# EAGLE design LED_Driver (EAGLE 9.7.0)
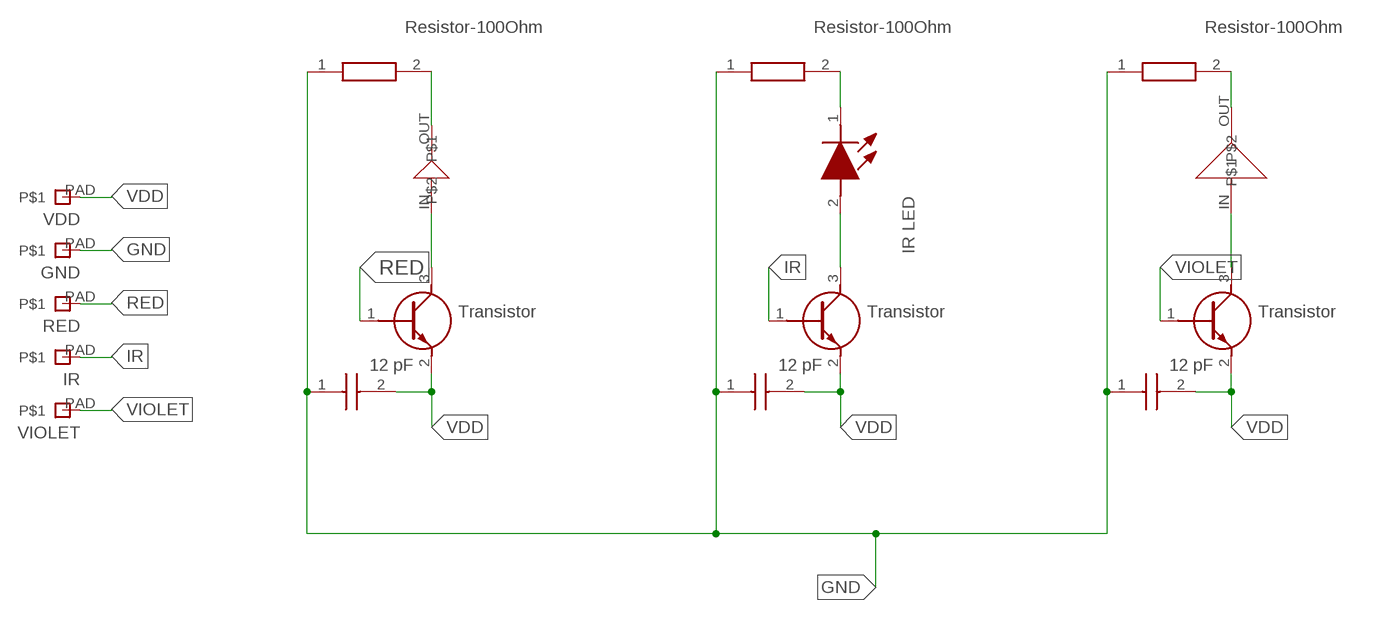
[diagram p0: schematic, sheet 1]

## Parts
C1  CAPACITOR-12PF  [CAPC1005X55N]
C3  CAPACITOR-12PF  [CAPC1005X55N]
C5  CAPACITOR-12PF  [CAPC1005X55N]
GND  PAD  [PAD]
IR  PAD  [PAD]
LED1  IRLED  [LEDC3216X180N]
Q1  TRANSISTOR  [SOT883B]
Q3  TRANSISTOR  [SOT883B]
Q5  TRANSISTOR  [SOT883B]
R1  RESISTOR-100OHM  [RESC1608X55N]
R3  RESISTOR-100OHM  [RESC1608X55N]
R5  RESISTOR-100OHM  [RESC1608X55N]
RED  PAD  [PAD]
U$1  REDLED  [REDLED]
U$3  UVLED  [UVLED]
VDD  PAD  [PAD]
VIOLET  PAD  [PAD]

## Nets
GND: C1.1 C3.1 C5.1 GND.PAD R1.1 R3.1 R5.1
IR: IR.PAD Q3.1(B)
N$7: Q1.3(C) U$1.IN
N$9: LED1.2(A) Q3.3(C)
N$11: Q5.3(C) U$3.IN
N$13: R1.2 U$1.OUT
N$15: LED1.1(K) R3.2
N$17: R5.2 U$3.OUT
RED: Q1.1(B) RED.PAD
VDD: C1.2 C3.2 C5.2 Q1.2(E) Q3.2(E) Q5.2(E) VDD.PAD
VIOLET: Q5.1(B) VIOLET.PAD

## Library data of the parts
C1 C3 C5 = MABOS_Library:CAPACITOR-12PF: 12 pF; DESCRIPTION: Multilayer Ceramic Capacitors MLCC - SMD/SMT 12pF 2% 25V C0G; HEIGHT: 0.55mm; MANUFACTURER_NAME: Kemet; MANUFACTURER_PART_NUMBER: C0402C120G3GACTU; MOUSER_PART_NUMBER: 80-C0402C120G3G; MOUSER_PRICE-STOCK: https://www.mouser.com/Search/Refine.aspx?Keyword=80-C0402C120G3G
GND IR RED VDD VIOLET = Nordic_BLE:PAD
LED1 = MABOS_Library:IRLED: Infrared Emitters 3.2x1.6mm IR SMD LED Source: Datasheet <https://www.arrow.com/en/products/aptd3216f3c-p22/kingbright>; DESCRIPTION: Infrared Emitters 3.2x1.6mm IR SMD LED; HEIGHT: 1.8mm; MANUFACTURER_NAME: Kingbright; MANUFACTURER_PART_NUMBER: APTD3216F3C-P22; MOUSER_PART_NUMBER: 604-APTD3216F3C-P22; MOUSER_PRICE-STOCK: https://www.mouser.co.uk/ProductDetail/Kingbright/APTD3216F3C-P22?qs=fAHHVMwC%252Bbjo55EMkwMBzg%3D%3D
Q1 Q3 Q5 = MABOS_Library:TRANSISTOR: Bipolar Transistors - BJT 45V NPN 100mA 250mW Source: Datasheet <https://componentsearchengine.com/Datasheets/1/BC847BMB,315.pdf>; DESCRIPTION: Bipolar Transistors - BJT 45V NPN 100mA 250mW; HEIGHT: mm; MANUFACTURER_NAME: Nexperia; MANUFACTURER_PART_NUMBER: BC847BMB,315; MOUSER_PART_NUMBER: 771-BC847BMB315; MOUSER_PRICE-STOCK: https://www.mouser.co.uk/ProductDetail/Nexperia/BC847BMB315?qs=5C9Q4QJFsuN7bUmIcU4LYw%3D%3D
R1 R3 R5 = MABOS_Library:RESISTOR-100OHM: Thick Film Resistors - SMD 100 OHM .1% 50PPM Source: Datasheet; DESCRIPTION: Thick Film Resistors - SMD 100 OHM .1% 50PPM; HEIGHT: 0.55mm; MANUFACTURER_NAME: KOA Speer; MANUFACTURER_PART_NUMBER: RS73G1JTTD1000B; MOUSER_PART_NUMBER: 660-RS73G1JTTD1000B; MOUSER_PRICE-STOCK: https://www.mouser.co.uk/ProductDetail/KOA-Speer/RS73G1JTTD1000B/?qs=GBLSl2AkiruQBcK7exZ%252Bcg%3D%3D
U$1 = MABOS_Library:REDLED
U$3 = MABOS_Library:UVLED

## Board
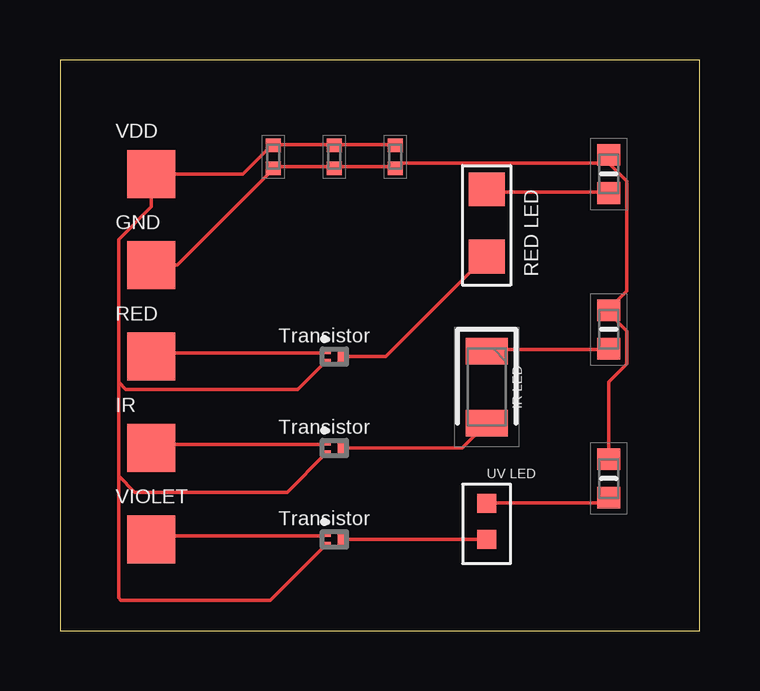
[diagram p1: board, top side]

Size 26.65 x 23.8 mm. Coordinates in mm from the lower left corner, seen from the top.
Outline: 0,0 26.65,0 26.65,23.8 0,23.8 0,0
Copper layers (1*16): Top / Bottom
Stack-up Default Layer Stack: Top User Defined 0.035mm / Dielectric-1 User Defined 1.5mm / Bottom User Defined 0.035mm
Design rules "default": minimum track width 6mil, minimum drill 0.35mm, track to track 6mil, track to pad 6mil, pad to pad 6mil, via to via 6mil, smd to smd 6mil, copper to edge 40mil, drill to drill 6mil, minimum pad ring 10mil, minimum via ring 8mil, stop-mask expansion 4mil, vias tented up to drill 0mil, thermal gap 10mil

### Footprints (pad centres in the part's own frame; a part is rotated, then mirrored left to right if it is on the bottom)
CAPC1005X55N = smd 0.56 x 0.62: 1 -0.48,1.27; 2 0.48,1.27
PAD = smd 2 x 2: PAD 0,0
LEDC3216X180N = smd 1.1 x 1.75: 1 -1.5,0; 2 1.5,0
SOT883B = smd 0.4 x 0.25: 1 -0.35,0.225; 2 -0.35,-0.225 | smd 0.4 x 0.7: 3 0.35,0
RESC1608X55N = smd 0.9 x 0.95: 1 -0.8,0; 2 0.8,0
REDLED = smd 1.4 x 1.5: IN 2.8,0; OUT 0,0
UVLED = smd 0.8 x 0.8: IN 0,0; OUT 0,1.5

### Placement (x,y rotation side)
C1  15.24,19.76 90 top
C3  12.7,19.76 90 top
C5  10.16,19.76 90 top
GND  3.81,15.24 0 top
IR  3.81,7.62 0 top
LED1  17.78,10.16 270 top
Q1  11.43,11.43 0 top
Q3  11.43,7.62 0 top
Q5  11.43,3.81 0 top
R1  22.86,19.05 270 top
R3  22.86,12.56 270 top
R5  22.86,6.35 270 top
RED  3.81,11.43 0 top
U$1  17.78,18.4 270 top
U$3  17.78,3.81 0 top
VDD  3.81,19.05 0 top
VIOLET  3.81,3.81 0 top

### Tracks (layer width: path | path; a pad name or v marks a point on that pad's centre or on a via)
GND
  Top 0.152: R5.1 22.86,10.36 23.62,11.12 23.62,12.5 22.86,13.26 R3.1 22.86,13.41 23.62,14.17 23.62,18.75 22.86,19.51 | 22.86,19.51 R1.1 22.86,19.81 | 11.43,19.36 8.99,19.36 C5.1 8.84,19.2 4.88,15.24 GND.PAD | 11.43,19.36 13.87,19.36 C1.1 14.02,19.36 14.17,19.51 22.86,19.51 | 11.43,19.36 C3.1
IR
  Top 0.152: IR.PAD 3.96,7.77 10.97,7.77 Q3.1
N$7
  Top 0.152: Q1.3 13.56,11.43 17.68,15.54 U$1.IN
N$9
  Top 0.152: Q3.3 16.76,7.62 17.68,8.53 LED1.2
N$11
  Top 0.152: U$3.IN Q5.3
N$13
  Top 0.152: R1.2 22.86,18.29 17.83,18.29 U$1.OUT
N$15
  Top 0.152: R3.2 22.86,11.73 17.83,11.73 LED1.1
N$17
  Top 0.152: U$3.OUT 17.83,5.33 22.71,5.33 22.86,5.49 R5.2
RED
  Top 0.152: RED.PAD 3.96,11.58 10.97,11.58 Q1.1
VDD
  Top 0.152: 11.43,20.27 8.99,20.27 C5.2 8.84,20.27 7.62,19.05 VDD.PAD 3.81,17.68 2.44,16.31 2.44,10.36 | 11.43,20.27 13.87,20.27 C1.2 | 11.43,20.27 C3.2 | 11.12,3.5 Q5.2 8.77,1.27 2.54,1.27 2.44,1.37 2.44,6.45 | 11.12,7.32 Q3.2 9.46,5.78 3.11,5.78 2.44,6.45 | 11.12,11.12 Q1.2 10.97,11.12 9.91,10.06 2.74,10.06 2.44,10.36 | 2.44,6.45 2.44,10.36
VIOLET
  Top 0.152: VIOLET.PAD 3.96,3.96 10.97,3.96 Q5.1